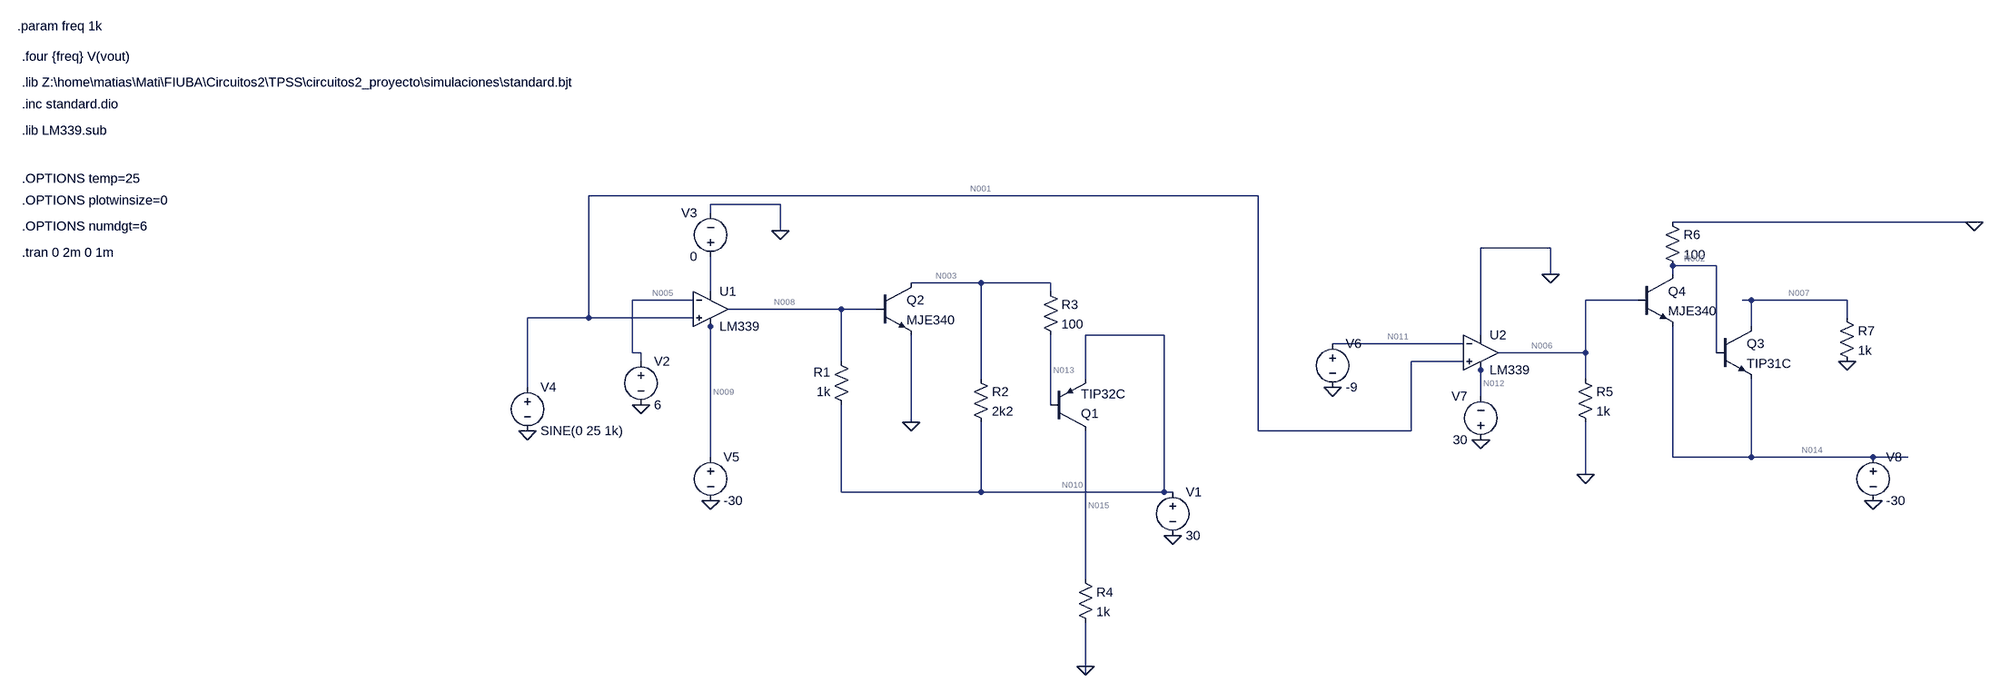
[diagram p0: schematic comparador.asc]
comparador.asc, the LTspice schematic file:
Version 4
SHEET 1 3124 968
WIRE 1200 48 -240 48
WIRE 112 64 -16 64
WIRE -16 80 -16 64
WIRE 3056 96 2016 96
WIRE 3072 96 3056 96
WIRE 112 112 112 64
WIRE 1792 144 1664 144
WIRE 2096 176 2016 176
WIRE 1792 192 1792 144
WIRE 2016 192 2016 176
WIRE 480 208 352 208
WIRE 608 208 480 208
WIRE -16 224 -16 160
WIRE 608 224 608 208
WIRE -48 240 -160 240
WIRE 1952 240 1856 240
WIRE 2160 240 2144 240
WIRE 2336 240 2160 240
WIRE 224 256 16 256
WIRE 288 256 224 256
WIRE -240 272 -240 48
WIRE -240 272 -352 272
WIRE -48 272 -240 272
WIRE 2336 272 2336 240
WIRE -16 288 -16 272
WIRE 2160 288 2160 240
WIRE 816 304 672 304
WIRE 1664 304 1664 144
WIRE 1632 320 1392 320
WIRE -160 336 -160 240
WIRE -144 336 -160 336
WIRE 1856 336 1856 240
WIRE 1856 336 1696 336
WIRE 2096 336 2096 176
WIRE -144 352 -144 336
WIRE 224 352 224 256
WIRE 1632 352 1536 352
WIRE 1664 368 1664 352
WIRE 480 384 480 208
WIRE 672 384 672 304
WIRE 1856 384 1856 336
WIRE -352 400 -352 272
WIRE 1664 416 1664 368
WIRE 608 432 608 304
WIRE 352 464 352 304
WIRE 1200 480 1200 48
WIRE 1536 480 1536 352
WIRE 1536 480 1200 480
WIRE -16 528 -16 288
WIRE 2016 528 2016 288
WIRE 2160 528 2160 384
WIRE 2160 528 2016 528
WIRE 2384 528 2160 528
WIRE 2448 528 2384 528
WIRE 1856 560 1856 464
WIRE 224 592 224 432
WIRE 480 592 480 464
WIRE 480 592 224 592
WIRE 816 592 816 304
WIRE 816 592 480 592
WIRE 832 592 816 592
WIRE 672 752 672 480
WIRE 672 912 672 832
WIRE 672 928 672 912
FLAG 832 672 0
FLAG -144 432 0
FLAG 112 112 0
FLAG -352 480 0
FLAG 672 912 0
FLAG 352 464 0
FLAG -16 608 0
FLAG 1792 192 0
FLAG 1664 496 0
FLAG 1856 560 0
FLAG 1392 400 0
FLAG 2384 608 0
FLAG 2336 352 0
FLAG 3056 96 0
SYMBOL voltage 832 576 R0
WINDOW 123 0 0 Left 0
WINDOW 39 0 0 Left 0
SYMATTR InstName V1
SYMATTR Value 30
SYMBOL Opamps\\opamp2 -16 192 R0
SYMATTR InstName U1
SYMATTR Value LM339
SYMBOL voltage -144 336 R0
WINDOW 123 0 0 Left 0
WINDOW 39 0 0 Left 0
SYMATTR InstName V2
SYMATTR Value 6
SYMBOL pnp 608 480 M180
SYMATTR InstName Q1
SYMATTR Value TIP32C
SYMBOL res 240 448 R180
WINDOW 0 36 76 Left 2
WINDOW 3 36 40 Left 2
SYMATTR InstName R1
SYMATTR Value 1k
SYMBOL npn 288 208 R0
SYMATTR InstName Q2
SYMATTR Value MJE340
SYMBOL res 464 368 R0
SYMATTR InstName R2
SYMATTR Value 2k2
SYMBOL res 592 208 R0
SYMATTR InstName R3
SYMATTR Value 100
SYMBOL voltage -352 384 R0
WINDOW 123 0 0 Left 0
WINDOW 39 0 0 Left 0
SYMATTR InstName V4
SYMATTR Value SINE(0 25 1k)
SYMBOL res 656 736 R0
SYMATTR InstName R4
SYMATTR Value 1k
SYMBOL voltage -16 512 R0
WINDOW 123 0 0 Left 0
WINDOW 39 0 0 Left 0
SYMATTR InstName V5
SYMATTR Value -30
SYMBOL npn 2096 288 R0
SYMATTR InstName Q3
SYMATTR Value TIP31C
SYMBOL Opamps\\opamp2 1664 272 R0
SYMATTR InstName U2
SYMATTR Value LM339
SYMBOL voltage 1392 304 R0
WINDOW 123 0 0 Left 0
WINDOW 39 0 0 Left 0
SYMATTR InstName V6
SYMATTR Value -9
SYMBOL res 1840 368 R0
SYMATTR InstName R5
SYMATTR Value 1k
SYMBOL voltage 1664 512 R180
WINDOW 0 24 96 Left 2
WINDOW 3 24 16 Left 2
WINDOW 123 0 0 Left 0
WINDOW 39 0 0 Left 0
SYMATTR InstName V7
SYMATTR Value 30
SYMBOL npn 1952 192 R0
SYMATTR InstName Q4
SYMATTR Value MJE340
SYMBOL res 2000 80 R0
SYMATTR InstName R6
SYMATTR Value 100
SYMBOL voltage 2384 512 R0
WINDOW 123 0 0 Left 0
WINDOW 39 0 0 Left 0
SYMATTR InstName V8
SYMATTR Value -30
SYMBOL res 2320 256 R0
SYMATTR InstName R7
SYMATTR Value 1k
SYMBOL voltage -16 176 R180
WINDOW 0 24 96 Left 2
WINDOW 3 24 16 Left 2
WINDOW 123 0 0 Left 0
WINDOW 39 0 0 Left 0
SYMATTR InstName V3
SYMATTR Value 0
TEXT -1280 -160 Left 2 !.lib Z:\\home\\matias\\Mati\\FIUBA\\Circuitos2\\TPSS\\circuitos2_proyecto\\simulaciones\\standard.bjt
TEXT -1280 -120 Left 2 !.inc standard.dio
TEXT -1280 -208 Left 2 !.four {freq} V(vout)
TEXT -1288 -264 Left 2 !.param freq 1k
TEXT -1280 -72 Left 2 !.lib LM339.sub
TEXT -1280 152 Left 2 !.tran 0 2m 0 1m
TEXT -1280 56 Left 2 !.OPTIONS plotwinsize=0
TEXT -1280 104 Left 2 !.OPTIONS numdgt=6
TEXT -1280 16 Left 2 !.OPTIONS temp=25

The netlist it stands for:
* comparador.asc
V1 N010 0 30
XU1 N001 N005 N004 N009 N008 LM339  ; pins In+ In- V+ V- OUT
V2 N005 0 6
Q1 N015 N013 N010 0 TIP32C
R1 N010 N008 1k
Q2 N003 N008 0 0 MJE340
R2 N003 N010 2k2
R3 N003 N013 100
V4 N001 0 SINE(0 25 1k)
R4 N015 0 1k
V5 N009 0 -30
Q3 N007 N002 N014 0 TIP31C
XU2 N001 N011 0 N012 N006 LM339  ; pins In+ In- V+ V- OUT
V6 N011 0 -9
R5 N006 0 1k
V7 0 N012 30
Q4 N002 N006 N014 0 MJE340
R6 0 N002 100
V8 N014 0 -30
R7 N007 0 1k
V3 N004 0 0
.model NPN NPN
.model PNP PNP
.lib standard.bjt
.lib Z:\home\matias\Mati\FIUBA\Circuitos2\TPSS\circuitos2_proyecto\simulaciones\standard.bjt
.inc standard.dio
.four {freq} V(vout)
.param freq 1k
.lib LM339.sub
.tran 0 2m 0 1m
.OPTIONS plotwinsize=0
.OPTIONS numdgt=6
.OPTIONS temp=25
.backanno
.end

* Results of the author's LTspice run, read from the files saved beside the schematic
* Operating Point, zero values left out:
*   V(n010) = 30 V
*   V(n005) = 6 V
*   V(n009) = -30 V
*   V(n008) = -29.83 V
*   V(n015) = 40.82 nV
*   V(n013) = 30 V
*   V(n003) = 30 V
*   V(n007) = -29.93 V
*   V(n002) = -29.26 V
*   V(n014) = -30 V
*   V(n011) = -9 V
*   V(n012) = -30 V
*   V(n006) = -29.19 V
*   Ic(Q3) = 29.93 mA
*   Ib(Q3) = 15.52 mA
*   Ie(Q3) = -45.46 mA
*   Ic(Q4) = 277.1 mA
*   Ib(Q4) = 29.19 mA
*   Ie(Q4) = -306.3 mA
*   Ic(Q2) = 59.92 pA
*   Ib(Q2) = -127.2 pA
*   Ie(Q2) = 67.31 pA
*   Ic(Q1) = -40.82 pA
*   Ib(Q1) = 40.12 pA
*   I(R7) = -29.93 mA
*   I(R6) = 292.6 mA
*   I(R5) = -29.19 mA
*   I(R4) = 40.82 pA
*   I(R3) = 40.12 pA
*   I(R2) = -100 pA
*   I(R1) = 59.83 mA
*   I(V3) = -648 µA
*   I(V8) = 351.8 mA
*   I(V7) = -747.9 µA
*   I(V6) = 49.95 nA
*   I(V5) = 60.48 mA
*   I(V4) = 49.91 nA
*   I(V2) = -41.8 pA
*   I(V1) = -59.83 mA
*   Ix(u1:1) = -49.95 nA
*   Ix(u1:2) = 41.8 pA
*   Ix(u1:3) = 648 µA
*   Ix(u1:4) = -60.48 mA
*   Ix(u1:5) = 59.83 mA
*   Ix(u2:1) = 39.07 pA
*   Ix(u2:2) = -49.95 nA
*   Ix(u2:3) = 747.9 µA
*   Ix(u2:4) = -747.9 µA
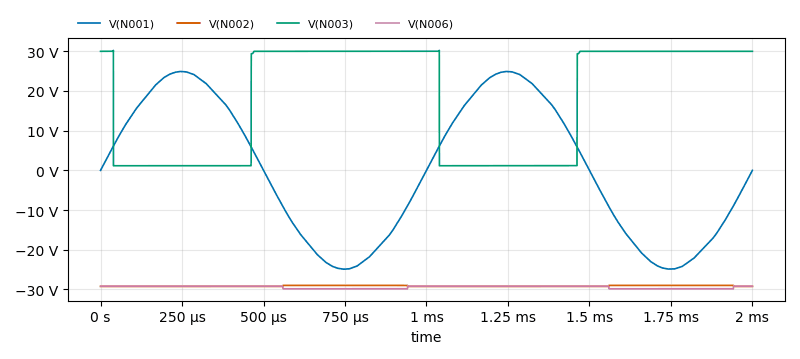
[diagram p1: Transient Analysis of comparador.asc, plotted from the saved traces]
* Transient Analysis, 1 run:
*   V(N001): min -24.91 V, max 24.92 V, average -12.37 mV, rms 17.49 V, last 0 V
*   V(N002): min -29.26 V, max -28.99 V, average -29.16 V, rms 29.16 V, last -29.26 V
*   V(N003): min 1.145 V, max 30.24 V, average 17.8 V, rms 22.8 V, last 30 V
*   V(N006): min -29.85 V, max -29.19 V, average -29.44 V, rms 29.45 V, last -29.19 V